# Altium schematic sheet MicroUSB.SchDoc: RFSOC SAWG
size 420 x 297 mm; Author: G.Kasprowicz; CompanyName: WUT ISE; DrawnBy: G.Kasprowicz; Organization: WUT ISE; Address1: PW ISE; Address2: Nowowiejska 15/19 00-665 Warsaw; Address3: gkasprow@gmail.com; Revision: 1; SheetNumber: 3; SheetTotal: 4; ModifiedBy: -; CheckedDate: -; Title2: USB; DivGrp: WUT ISE; Designer: G.Kasprowicz; ModifiedDate: -; ProjectName: Sensor Box
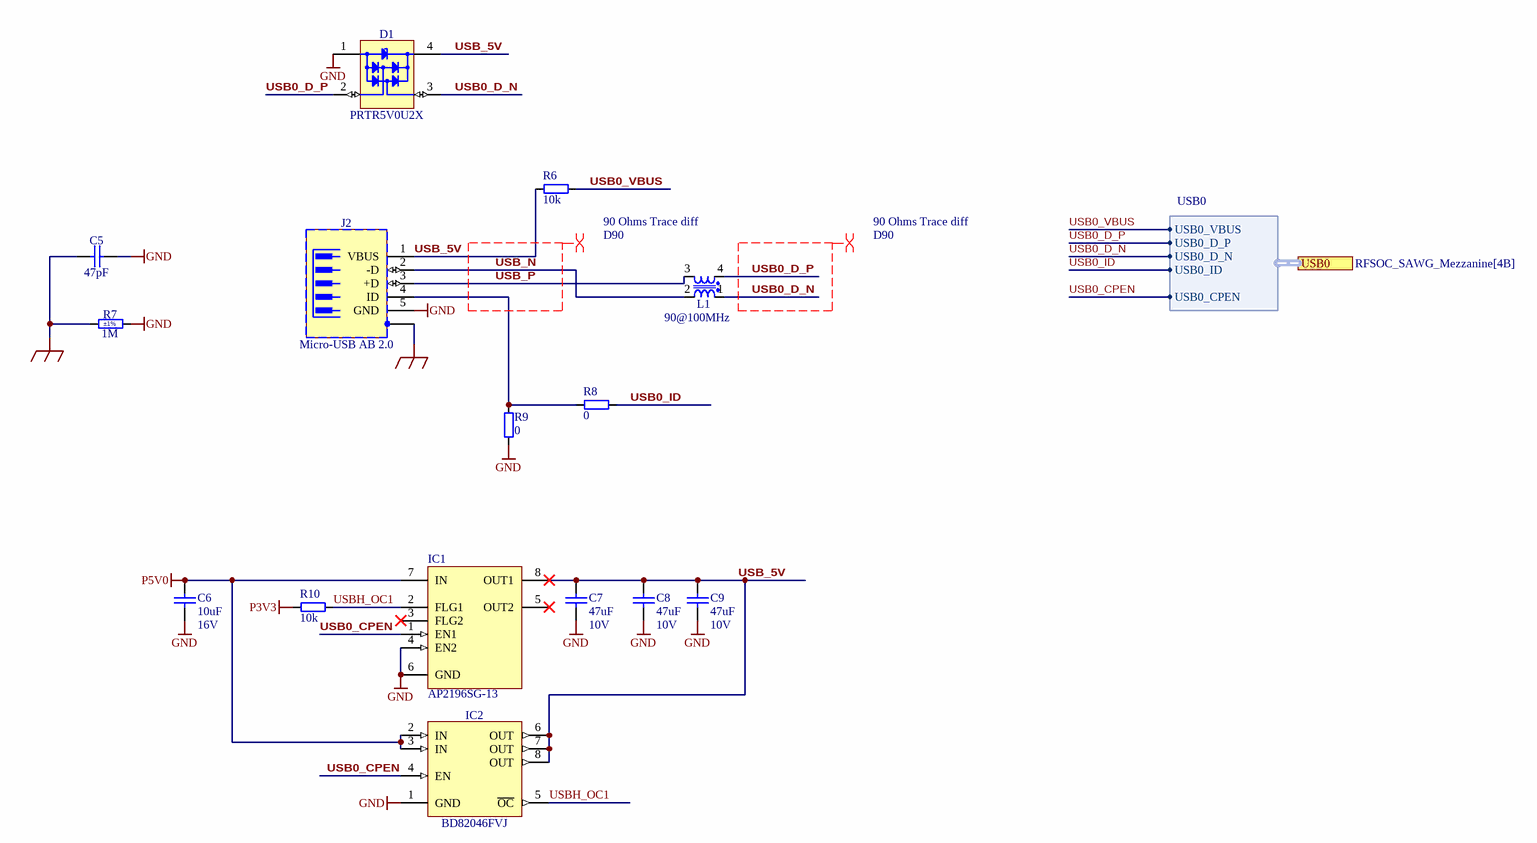
[diagram p0: MicroUSB.SchDoc]

## Parts
C5  47pF  [CAPC3216X140N]
C6  10uF  Voltage: 16V  [CAPC1608X80N]
C7  47uF  Voltage: 10V  [CAPC3216X180N]
C8  47uF  Voltage: 10V  [CAPC3216X180N]
C9  47uF  Voltage: 10V  [CAPC3216X180N]
D1  PRTR5V0U2X  [SOT190P230X110-4N]
IC1  AP2196SG-13  [SOIC127P600X175-8N]
IC2  BD82046FVJ  [SOP65P490X110-8N]
J2  Micro-USB AB 2.0  [HIROSE_ZX62RD-AB-5P8]
L1  90@100MHz  [IND_WURTH_WE-CNSW_0504]
R6  10k  [RESC1005X40N]
R7  1M  Tolerance: ±1%  [RESC3216X65N]
R8  0  [RESC1005X40N]
R9  0  [RESC1005X40N]
R10  10k  [RESC1005X40N]

## Ports
USB0 (harness USB0, see RFSOC_SAWG_Mezzanine[4B])

## Harnesses
USB0: USB0_VBUS, USB0_D_P, USB0_D_N, USB0_ID, USB0_CPEN

## Nets
FGND: C5.1 J2.6(SH) R7.1
GND: C5.2 C6.2 C7.2 C8.1 C9.1 D1.1(GND) IC1.4(EN2) IC1.6(GND) IC2.1(GND) J2.5(GND) R7.2 R9.1
P3V3: R10.1
P5V0: C6.1 IC1.7(IN) IC2.2(IN) IC2.3(IN)
USB0_CPEN: IC1.1(EN1) IC2.4(EN) ; port USB0.USB0_CPEN
USB0_D_N: D1.3(I/O2) L1.1 ; port USB0.USB0_D_N
USB0_D_P: D1.2(I/O1) L1.4 ; port USB0.USB0_D_P
USB0_ID: R8.2 ; port USB0.USB0_ID
USB0_VBUS: R6.2 ; port USB0.USB0_VBUS
USB_5V: C7.1 C8.2 C9.2 D1.4(VCC) IC1.8(OUT1) IC2.6(OUT) IC2.7(OUT) IC2.8(OUT) J2.1(VBUS) R6.1
USB_N: J2.2(-D) L1.2
USB_P: J2.3(+D) L1.3
USBH_OC1: IC1.2(FLG1) IC2.5(~{OC}) R10.2
NetJ2_4: J2.4(ID) R8.1 R9.2

Not connected (* = marked no-connect by the designer): IC1 3(FLG2)* 5(OUT2)*

## Layout directives
differential pair; differential pair class 90 Ohms Trace diff; net class D90: USB0_D_N, USB0_D_P, USB_N, USB_P

## Notes on the sheet
- Project/Equipment
- Document
- Designer
- Drawn by
- Check.by
- Copyright WUT ISE 2020.
  This documentation describes Open Hardware and is licensed under the CERN OHL v.1.2. You may redistribute and modify this documentation under the terms of the CERN OHL v.1.2. (http://ohwr.org/CERNOHL). This documentation is distributed WITHOUT ANY EXPRESS OR IMPLIED WARRANTY, INCLUDING OF MERCHANTABILITY, SATISFACTORY QUALITY AND FITNESS FOR A PARTICULAR PURPOSE. Please see the CERN OHL v.1.2 for applicable conditions.
- Contact
- File
- Last Mod.
- Print Date
- Sheet
- Size
- A3
- of
- Rev

## Library data of the parts
C5 = CC1206_47PF_1KV_10%_C0G: Non-polarised capacitor; Part Description: High Voltage MLC Chip Capacitor; Manufacturer: GENERIC; Manufacturer1 Part Number: 1206AA470KAT1A; Voltage: 1KV; TC: C0G/NP0; Tolerance: ±10%; Part Number: CC1206_47PF_1KV_10%_C0G; Component Kind: Standard; Component Type: Standard; Pin Count: 2; Value: 47pF; Status: None; Manufacturer Part Number: CC1206_47PF_1KV_10%_C0G; Case: 1206; Mounted: Yes; Socket: No; SMD: Yes; Sense: No; Manufacturer1 Example: AVX; Manufacturer1 ComponentHeight: 1.45mm; HelpURL: \\cern.ch\dfs\Applications\Altium\Datasheets\CC1206_C0G_AVX_HV-MLC.pdf; Author: CERN DEM BC; CreateDate: 14.12.2021; LatestRevisionDate: 14.12.2021
C6 = CC0603_10UF_16V_20%_X5R: Non-polarised capacitor; Part Description: SMD Multilayer Chip Ceramic Capacitor; Manufacturer: GENERIC; Manufacturer1 Part Number: GRM188R61C106MA73D; Tolerance: ±20%; TC: X5R; Case: 0603; Value: 10uF; Part Number: CC0603_10UF_16V_20%_X5R; Component Kind: Standard; Component Type: Standard; Pin Count: 2; Status: None; Manufacturer Part Number: CC0603_10UF_16V_20%_X5R; Mounted: Yes; Socket: No; SMD: Yes; Sense: No; Manufacturer1 Example: MURATA; Manufacturer1 ComponentHeight: 0.8mm; HelpURL: \\cern.ch\dfs\Applications\Altium\Datasheets\CC0603_X5R_MURATA_GRM.pdf; Author: CERN DEM MR; CreateDate: 02.03.2016; LatestRevisionDate: 02.03.2016
C7-C9 = CC1206_47UF_10V_10%_X5R: Non-polarised capacitor; Part Description: SMD Multilayer Chip Ceramic Capacitor; Manufacturer: GENERIC; Manufacturer1 Part Number: GRM31CR61A476KE15; Tolerance: ±10%; TC: X5R; Case: 1206; Value: 47uF; Part Number: CC1206_47UF_10V_10%_X5R; Component Kind: Standard; Component Type: Standard; Pin Count: 2; Status: None; Manufacturer Part Number: CC1206_47UF_10V_10%_X5R; Mounted: Yes; Socket: No; SMD: Yes; Sense: No; Manufacturer1 Example: MURATA; Manufacturer1 ComponentHeight: 1.8mm; HelpURL: \\cern.ch\dfs\Applications\Altium\Datasheets\CC1206_X5R_MURATA_GRM.pdf; Author: CERN DEM MR; CreateDate: 24.06.2016; LatestRevisionDate: 24.06.2016
D1 = PRTR5V0U2X: Ultra Low Capacitance Double Rail-to-Rail ESD Protection Diode; Part Description: Ultra Low Capacitance (1pF) Double Rail-to-Rail ESD Protection Diode (8kV); Manufacturer: NXP SEMICONDUCTORS; Voltage: 5.5V; PressFit: No; Bonding: No; Part Number: PRTR5V0U2X; Component Kind: Standard; Component Type: Standard; Device: PRTR5V0U2X; PackageDescription: SOT143B, SOT, 1.90mm Pitch; 4 Pin, 1.30mm W X 2.90mm L X 1.10mm H body, IPC Medium Density; Manufacturer Part Number: PRTR5V0U2X; Pin Count: 4; Case: SOT143B; Mounted: Yes; Socket: No; SMD: Yes; Sense: No; ComponentHeight: 1.1mm; HelpURL: \\cern.ch\dfs\Applications\Altium\Datasheets\PRTR5V0U2X.pdf; Author: CERN DEM JLC; CreateDate: 22.03.2011; LatestRevisionDate: 22.03.2011
IC1 = 27514: AN: 27514; Mixed: SMT; Extra: USB-Schalter-ICs 2x1.5A 2.7V-5.5V; Case: SO8; HelpURL: b:\AD\adlib\datasheet\AP21x6\; H-ART: AP2196SG-13
IC2 = BD82046FVJ: 3.2A Current Limit High Side Switch IC; Manufacturer: ROHM; PressFit: No; Bonding: No; Part Number: BD82046FVJ; Component Kind: Standard; Component Type: Standard; Device: BD82046FVJ; PackageDescription: SOP, 0.65mm Pitch; 8 Pin, 3.00mm W X 3.00mm L X 1.10mm H body, IPC Medium Density; Part Description: 3.2A Current Limit High Side Switch IC; Manufacturer Part Number: BD82046FVJ; Pin Count: 8; Case: TSSOP8; Mounted: Yes; Socket: No; SMD: Yes; Sense: No; ComponentHeight: 1.1mm; Author: CERN DEM BC; HelpURL: \\cern.ch\dfs\Applications\Altium\Datasheets\BD82046FVJ.pdf; CreateDate: 14.06.2021; LatestRevisionDate: 14.06.2021
J2 = HIROSE_ZX62RD-AB-5P8: 5 Pin + 1 Shield USB Receptacle; Part Description: Micro-USB 2.0 Right Angle, SMD Type AB - Reverse (Top mount), Shell Through Hole; Manufacturer: HIROSE (HRS); PressFit: No; Part Number: HIROSE_ZX62RD-AB-5P8; Component Kind: Standard; Component Type: Standard; Pin Count: 7; Family: Micro-USB AB 2.0; Mounted: Yes; Socket: No; SMD: Yes; Sense: No; Status: Obsolete; Manufacturer Part Number: ZX62RD-AB-5P8; ComponentHeight: 2.35mm; HelpURL: \\cern.ch\dfs\Applications\Altium\Datasheets\HIROSE_ZX62RD-AB-5P8.pdf; ComponentLink1URL: \\cern.ch\dfs\Applications\Altium\Datasheets\HIROSE_ZX62RD-AB-5P8_Package-Drawing.pdf; ComponentLink1Description: Package-Drawing; Author: CERN DEM JLC; CreateDate: 29.10.2014; LatestRevisionDate: 22.06.2017
L1 = IND0504_WURTH_7442335900: Inductor Common Mode; Part Description: Common Mode SMD Line Filter (WE-CNSW Series); Manufacturer: WURTH ELEKTRONIK; Power: 500mA; Resistance: 0.27R; Tolerance: ±25%; Part Number: IND0504_WURTH_7442335900; Component Kind: Standard; Component Type: Standard; Pin Count: 4; Value: 90@100MHz; Manufacturer Part Number: 7442335900; Case: 0504; Mounted: Yes; Socket: No; SMD: Yes; Sense: No; ComponentHeight: 1.1mm; HelpURL: \\cern.ch\dfs\Applications\Altium\Datasheets\IND0504_WURTH_7442335900.pdf; Author: CERN DEM JMW; CreateDate: 17.10.2019; LatestRevisionDate: 17.10.2019
R6 R10 = R0402_10K_1%_0.0625W_100PPM: Resistor - 1%; Part Description: General Purpose Thick Film Chip Resistor; Manufacturer: GENERIC; Manufacturer1 Part Number: 232270671003L; TC: ±100ppm/°C; PressFit: No; Tolerance: ±1%; Case: 0402; Value: 10k; Part Number: R0402_10K_1%_0.0625W_100PPM; Component Kind: Standard; Component Type: Standard; Pin Count: 2; Status: Not Recommended; Power: 0.0625W; Manufacturer Part Number: R0402_10K_1%_0.0625W_100PPM; Mounted: Yes; Sense: No; Socket: No; SMD: Yes; Manufacturer1 Example: YAGEO PHYCOMP; Manufacturer1 ComponentHeight: 0.4mm; HelpURL: \\cern.ch\dfs\Applications\Altium\Datasheets\R0402_Phycomp_RC0402.pdf; Author: CERN DEM JLC; CreateDate: 03.12.2007; LatestRevisionDate: 17.10.2012
R7 = R1206_1M_1%_0.25W_100PPM: Resistor - 1%; Part Description: General Purpose Thick Film Chip Resistor; Manufacturer: GENERIC; Manufacturer1 Part Number: NRC12F1004TRF; Power: 0.25W; TC: ±100ppm/°C; PressFit: No; Part Number: R1206_1M_1%_0.25W_100PPM; Component Kind: Standard; Component Type: Standard; Pin Count: 2; Value: 1M; Status: Preferred; Manufacturer Part Number: R1206_1M_1%_0.25W_100PPM; Case: 1206; Mounted: Yes; Sense: No; Socket: No; SMD: Yes; Manufacturer1 Example: NIC COMPONENT; Manufacturer1 ComponentHeight: 0.65mm; HelpURL: \\cern.ch\dfs\Applications\Altium\Datasheets\R1206_NIC_NRC.pdf; Author: CERN DEM JLC; CreateDate: 03.12.2007; LatestRevisionDate: 13.03.2008
R8 R9 = R0402_0R_JUMPER: Resistor; Part Description: 1A (0.05R Max DC Resistance) Zero Ohm Jumper; Manufacturer: GENERIC; Manufacturer1 Part Number: 232270591001L; PressFit: No; Case: 0402; Value: 0; Part Number: R0402_0R_JUMPER; Component Kind: Standard; Component Type: Standard; Pin Count: 2; Status: Not Recommended; Manufacturer Part Number: R0402_0R_JUMPER; Mounted: Yes; Sense: No; Socket: No; SMD: Yes; Manufacturer1 Example: YAGEO PHYCOMP; Manufacturer1 ComponentHeight: 0.4mm; HelpURL: \\cern.ch\dfs\Applications\Altium\Datasheets\R0402_Phycomp_RC0402.pdf; Author: CERN DEM JLC; CreateDate: 03.12.2007; LatestRevisionDate: 17.10.2012